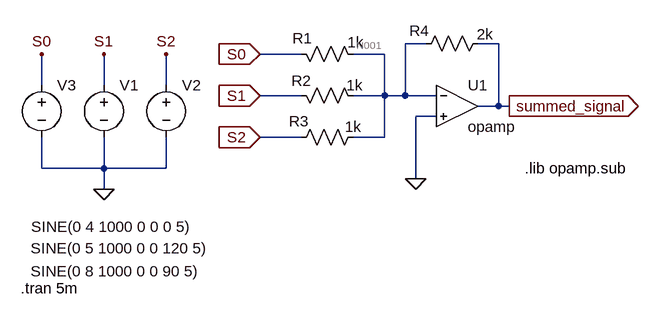
[diagram p0: schematic Summing-amp.asc]
Summing-amp.asc, the LTspice schematic file:
Version 4.1
SHEET 1 1064 840
WIRE 176 96 144 96
WIRE 288 96 256 96
WIRE -16 112 -80 112
WIRE 112 112 64 112
WIRE -416 160 -416 112
WIRE -320 160 -320 112
WIRE -224 160 -224 112
WIRE -16 176 -80 176
WIRE 112 176 112 112
WIRE 112 176 64 176
WIRE 144 176 144 96
WIRE 144 176 112 176
WIRE 192 176 144 176
WIRE 288 192 288 96
WIRE 288 192 256 192
WIRE 304 192 288 192
WIRE 192 208 160 208
WIRE -16 240 -80 240
WIRE 112 240 112 176
WIRE 112 240 64 240
WIRE -416 288 -416 240
WIRE -320 288 -320 240
WIRE -320 288 -416 288
WIRE -224 288 -224 240
WIRE -224 288 -320 288
WIRE 160 304 160 208
WIRE -320 320 -320 288
FLAG 160 304 0
FLAG 304 192 summed_signal
IOPIN 304 192 Out
FLAG -80 112 S0
IOPIN -80 112 In
FLAG -80 176 S1
IOPIN -80 176 In
FLAG -80 240 S2
IOPIN -80 240 In
FLAG -320 320 0
FLAG -416 112 S0
FLAG -320 112 S1
FLAG -224 112 S2
SYMBOL OpAmps\\opamp 224 128 R0
SYMATTR InstName U1
SYMBOL res -32 96 M90
WINDOW 0 7 18 VBottom 2
WINDOW 3 -18 100 VTop 2
SYMATTR InstName R1
SYMATTR Value 1k
SYMBOL res -32 160 M90
WINDOW 0 9 16 VBottom 2
WINDOW 3 -16 98 VTop 2
SYMATTR InstName R2
SYMATTR Value 1k
SYMBOL res 80 224 R90
WINDOW 0 7 100 VBottom 2
WINDOW 3 -16 16 VTop 2
SYMATTR InstName R3
SYMATTR Value 1k
SYMBOL res 272 80 R90
WINDOW 0 12 106 VBottom 2
WINDOW 3 -14 5 VTop 2
SYMATTR InstName R4
SYMATTR Value 2k
SYMBOL voltage -320 144 R0
WINDOW 3 -113 267 Left 2
WINDOW 123 0 0 Left 0
WINDOW 39 0 0 Left 0
SYMATTR Value SINE(0 5 1000 0 0 120 5)
SYMATTR InstName V1
SYMBOL voltage -224 144 R0
WINDOW 3 -209 302 Left 2
WINDOW 123 0 0 Left 0
WINDOW 39 0 0 Left 0
SYMATTR Value SINE(0 8 1000 0 0 90 5)
SYMATTR InstName V2
SYMBOL voltage -416 144 R0
WINDOW 3 -16 234 Left 2
WINDOW 123 0 0 Left 0
WINDOW 39 0 0 Left 0
SYMATTR Value SINE(0 4 1000 0 0 0 5)
SYMATTR InstName V3
TEXT -448 472 Left 2 !.tran 5m
TEXT 328 288 Left 2 !.lib opamp.sub

The netlist it stands for:
* Summing-amp.asc
X§U1 N001 0 summed_signal opamp Aol=100K GBW=10Meg  ; pins invin noninvin out
R1 S0 N001 1k
R2 S1 N001 1k
R3 N001 S2 1k
R4 summed_signal N001 2k
V1 S1 0 SINE(0 5 1000 0 0 120 5)
V2 S2 0 SINE(0 8 1000 0 0 90 5)
V3 S0 0 SINE(0 4 1000 0 0 0 5)
.tran 5m
.lib opamp.sub
.backanno
.end

* Results of the author's LTspice run, read from the files saved beside the schematic
* Operating Point, zero values left out:
*   V(n001) = 246.7 µV
*   V(s1) = 4.33 V
*   V(s2) = 8 V
*   V(summed_signal) = -24.66 V
*   I(R1) = -246.7 nA
*   I(R2) = 4.33 mA
*   I(R3) = -8 mA
*   I(R4) = -12.33 mA
*   I(V1) = -4.33 mA
*   I(V2) = -8 mA
*   I(V3) = 246.7 nA
*   Ix(u1:3) = 12.33 mA
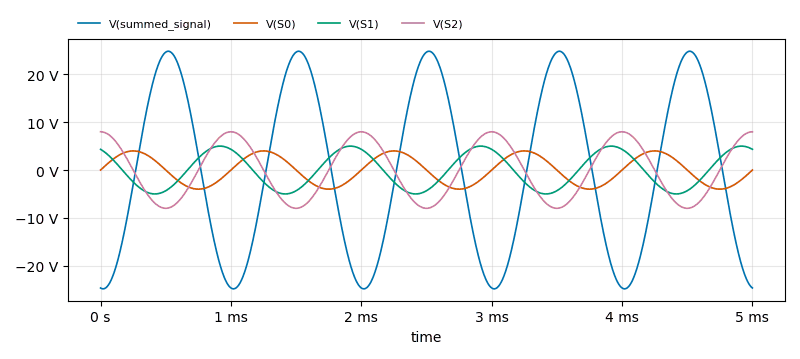
[diagram p1: Transient Analysis of Summing-amp.asc, plotted from the saved traces]
* Transient Analysis, 1 run:
*   V(summed_signal): min -24.84 V, max 24.84 V, average -2.599 µV, rms 17.56 V, last -24.66 V
*   V(S0): min -4 V, max 4 V, average 0 V, rms 2.828 V, last 0 V
*   V(S1): min -5 V, max 5 V, average 0 V, rms 3.536 V, last 4.33 V
*   V(S2): min -8 V, max 8 V, average 827.5 nV, rms 5.657 V, last 8 V